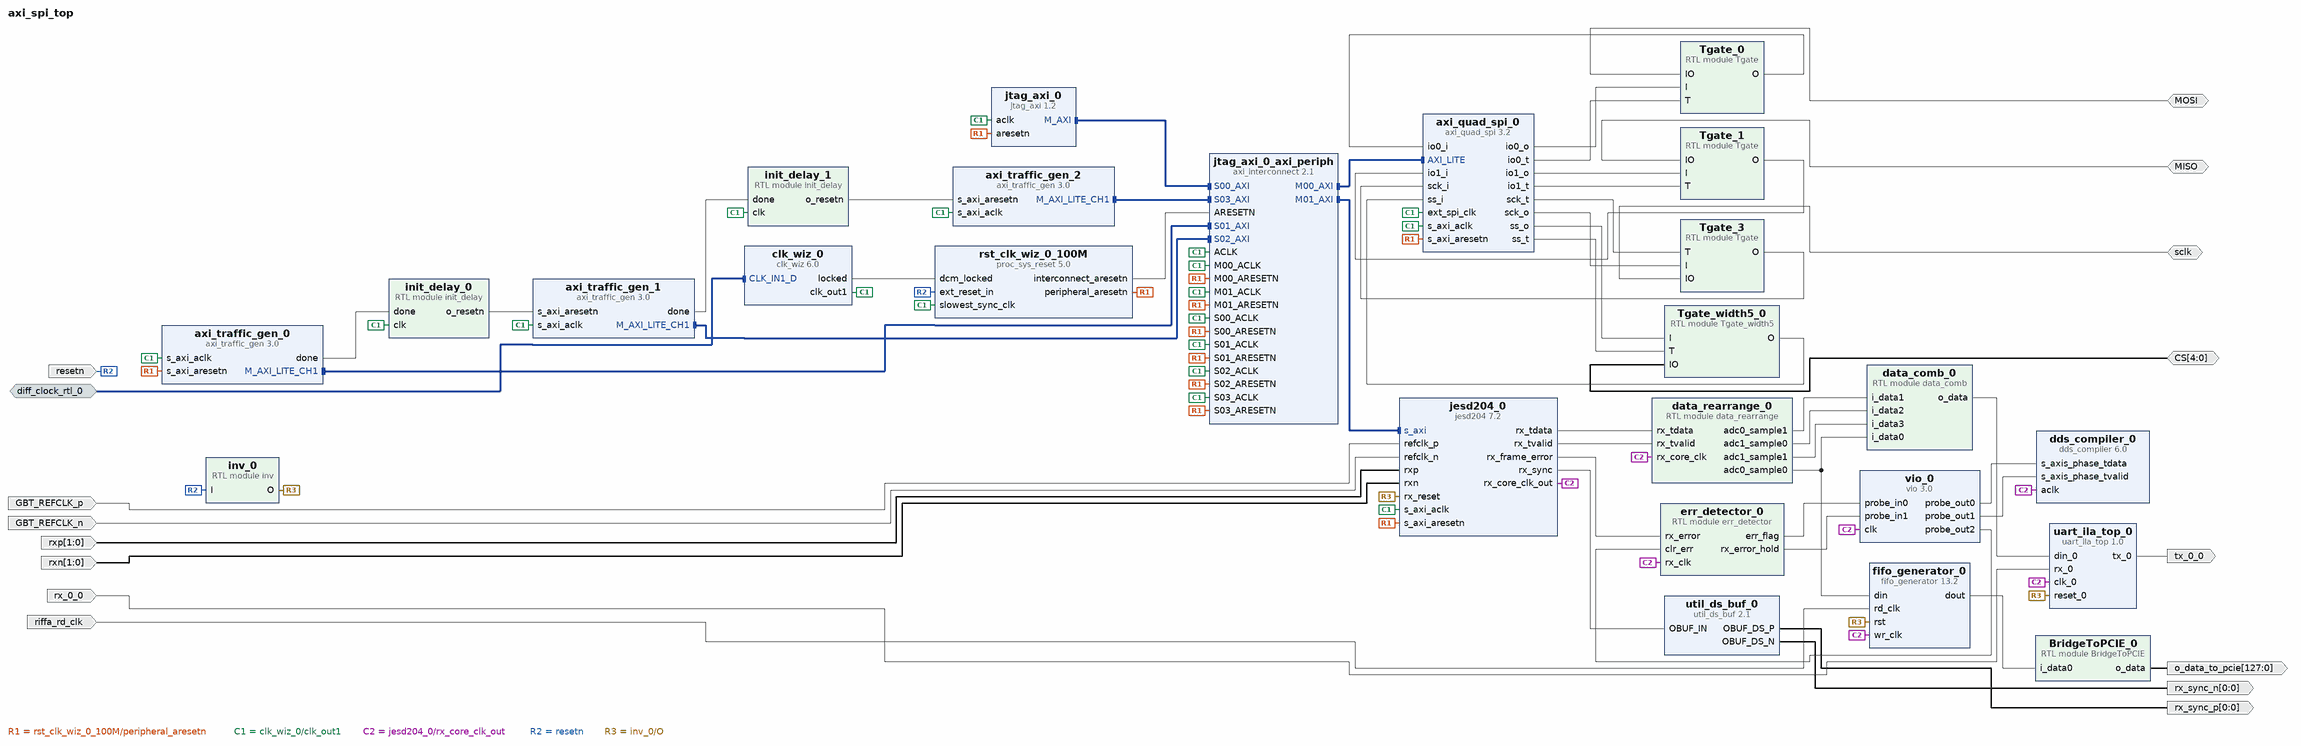
[diagram p0: block diagram of the top level]
# Vivado block design axi_spi_top, xc7k325tffg900-2, Vivado 2018.1
create_bd_design axi_spi_top

create_bd_intf_port -mode Slave -vlnv xilinx.com:interface:diff_clock_rtl:1.0 diff_clock_rtl_0
set_property -dict {CONFIG.FREQ_HZ 200000000} [get_bd_intf_ports diff_clock_rtl_0]
create_bd_port -dir IO -type data MOSI
create_bd_port -dir IO -type data MISO
create_bd_port -dir IO -type clk sclk
set_property -dict {CONFIG.FREQ_HZ 1000000} [get_bd_ports sclk]
create_bd_port -dir IO -from 4 -to 0 CS
create_bd_port -dir I -type clk GBT_REFCLK_p
set_property -dict {CONFIG.FREQ_HZ 125000000} [get_bd_ports GBT_REFCLK_p]
create_bd_port -dir I -type clk GBT_REFCLK_n
set_property -dict {CONFIG.FREQ_HZ 125000000} [get_bd_ports GBT_REFCLK_n]
create_bd_port -dir I -from 1 -to 0 rxp
create_bd_port -dir I -from 1 -to 0 rxn
create_bd_port -dir O -from 0 -to 0 rx_sync_p
create_bd_port -dir O -from 0 -to 0 rx_sync_n
create_bd_port -dir I -type rst resetn
set_property -dict {CONFIG.POLARITY ACTIVE_LOW} [get_bd_ports resetn]
create_bd_port -dir I rx_0_0
create_bd_port -dir O tx_0_0
create_bd_port -dir I -type clk riffa_rd_clk
set_property -dict {CONFIG.FREQ_HZ 100000000} [get_bd_ports riffa_rd_clk]
create_bd_port -dir O -from 127 -to 0 o_data_to_pcie

create_bd_cell -type ip -vlnv xilinx.com:ip:axi_quad_spi:3.2 axi_quad_spi_0
set_property -dict [list \
  CONFIG.C_USE_STARTUP 0 \
  CONFIG.C_NUM_TRANSFER_BITS 16 \
  CONFIG.C_NUM_SS_BITS 5 \
  CONFIG.C_SCK_RATIO 16 \
  CONFIG.C_FIFO_DEPTH 256 \
  CONFIG.Multiples16 5 \
  CONFIG.C_S_AXI4_ID_WIDTH 0 \
] [get_bd_cells axi_quad_spi_0]
create_bd_cell -type ip -vlnv xilinx.com:ip:clk_wiz:6.0 clk_wiz_0
set_property -dict [list \
  CONFIG.PRIM_IN_FREQ 200 \
  CONFIG.CLKIN1_JITTER_PS 50.0 \
  CONFIG.CLKOUT2_USED true \
  CONFIG.CLKOUT3_USED false \
  CONFIG.NUM_OUT_CLKS 2 \
  CONFIG.CLKOUT1_REQUESTED_OUT_FREQ 100 \
  CONFIG.CLKOUT2_REQUESTED_OUT_FREQ 50 \
  CONFIG.CLKOUT3_REQUESTED_OUT_FREQ 5 \
  CONFIG.PRIM_SOURCE Differential_clock_capable_pin \
  CONFIG.MMCM_DIVCLK_DIVIDE 1 \
  CONFIG.MMCM_CLKFBOUT_MULT_F 5.000 \
  CONFIG.MMCM_CLKIN1_PERIOD 5.000 \
  CONFIG.MMCM_CLKIN2_PERIOD 10.0 \
  CONFIG.MMCM_CLKOUT0_DIVIDE_F 10.000 \
  CONFIG.MMCM_CLKOUT1_DIVIDE 20 \
  CONFIG.MMCM_CLKOUT2_DIVIDE 1 \
  CONFIG.CLKOUT1_JITTER 112.316 \
  CONFIG.CLKOUT1_PHASE_ERROR 89.971 \
  CONFIG.CLKOUT2_JITTER 129.198 \
  CONFIG.CLKOUT2_PHASE_ERROR 89.971 \
  CONFIG.CLKOUT3_JITTER 185.602 \
  CONFIG.CLKOUT3_PHASE_ERROR 92.989 \
] [get_bd_cells clk_wiz_0]
create_bd_cell -type ip -vlnv xilinx.com:ip:jtag_axi:1.2 jtag_axi_0
create_bd_cell -type ip -vlnv xilinx.com:ip:axi_interconnect:2.1 jtag_axi_0_axi_periph
set_property -dict {CONFIG.NUM_SI 4 CONFIG.NUM_MI 2} [get_bd_cells jtag_axi_0_axi_periph]
create_bd_cell -type ip -vlnv xilinx.com:ip:proc_sys_reset:5.0 rst_clk_wiz_0_100M
create_bd_cell -type module -reference Tgate Tgate_0
create_bd_cell -type module -reference Tgate Tgate_1
create_bd_cell -type module -reference Tgate Tgate_3
create_bd_cell -type module -reference Tgate_width5 Tgate_width5_0
create_bd_cell -type ip -vlnv xilinx.com:ip:jesd204:7.2 jesd204_0
set_property -dict [list \
  CONFIG.C_NODE_IS_TRANSMIT 0 \
  CONFIG.SupportLevel 1 \
  CONFIG.GT_Line_Rate 5 \
  CONFIG.GT_REFCLK_FREQ 125.000 \
  CONFIG.Global_clk_sel false \
  CONFIG.AXICLK_FREQ 100 \
] [get_bd_cells jesd204_0]
create_bd_cell -type ip -vlnv xilinx.com:ip:util_ds_buf:2.1 util_ds_buf_0
set_property -dict {CONFIG.C_BUF_TYPE OBUFDS} [get_bd_cells util_ds_buf_0]
create_bd_cell -type module -reference inv inv_0
create_bd_cell -type module -reference data_rearrange data_rearrange_0
create_bd_cell -type ip -vlnv xilinx.com:ip:axi_traffic_gen:3.0 axi_traffic_gen_0
set_property -dict [list \
  CONFIG.C_ATG_SYSTEM_INIT_DATA_MIF ../axi_spi_top_axi_traffic_gen_0_data.coe \
  CONFIG.C_ATG_SYSTEM_INIT_ADDR_MIF ../axi_spi_top_axi_traffic_gen_0_address.coe \
  CONFIG.C_ATG_MODE AXI4-Lite \
  CONFIG.C_ATG_MIF_DATA_DEPTH 32 \
] [get_bd_cells axi_traffic_gen_0]
create_bd_cell -type module -reference init_delay init_delay_0
create_bd_cell -type ip -vlnv xilinx.com:ip:axi_traffic_gen:3.0 axi_traffic_gen_1
set_property -dict [list \
  CONFIG.C_ATG_SYSTEM_INIT_DATA_MIF ../axi_spi_top_axi_traffic_gen_1_data.coe \
  CONFIG.C_ATG_SYSTEM_INIT_ADDR_MIF ../axi_spi_top_axi_traffic_gen_1_address.coe \
  CONFIG.C_ATG_MODE AXI4-Lite \
  CONFIG.C_ATG_MIF_DATA_DEPTH 32 \
] [get_bd_cells axi_traffic_gen_1]
create_bd_cell -type ip -vlnv xilinx.com:ip:axi_traffic_gen:3.0 axi_traffic_gen_2
set_property -dict [list \
  CONFIG.C_ATG_SYSTEM_INIT_DATA_MIF ../axi_spi_top_axi_traffic_gen_2_data.coe \
  CONFIG.C_ATG_SYSTEM_INIT_ADDR_MIF ../axi_spi_top_axi_traffic_gen_2_address.coe \
  CONFIG.C_ATG_MODE AXI4-Lite \
  CONFIG.C_ATG_MIF_DATA_DEPTH 32 \
] [get_bd_cells axi_traffic_gen_2]
create_bd_cell -type module -reference init_delay init_delay_1
create_bd_cell -type ip -vlnv xilinx.com:ip:dds_compiler:6.0 dds_compiler_0
set_property -dict [list \
  CONFIG.DDS_Clock_Rate 125 \
  CONFIG.Channels 1 \
  CONFIG.Parameter_Entry Hardware_Parameters \
  CONFIG.Frequency_Resolution 0.4 \
  CONFIG.Noise_Shaping None \
  CONFIG.Phase_Width 16 \
  CONFIG.Output_Width 14 \
  CONFIG.Phase_Increment Streaming \
  CONFIG.Output_Selection Sine \
  CONFIG.Has_Phase_Out false \
  CONFIG.DATA_Has_TLAST Not_Required \
  CONFIG.S_PHASE_Has_TUSER Not_Required \
  CONFIG.M_DATA_Has_TUSER Not_Required \
  CONFIG.M_PHASE_Has_TUSER Not_Required \
  CONFIG.Latency 7 \
  CONFIG.Output_Frequency1 0 \
  CONFIG.PINC1 0 \
] [get_bd_cells dds_compiler_0]
create_bd_cell -type ip -vlnv xilinx.com:ip:vio:3.0 vio_0
set_property -dict [list \
  CONFIG.C_PROBE_OUT1_INIT_VAL 0x1 \
  CONFIG.C_PROBE_OUT0_WIDTH 16 \
  CONFIG.C_NUM_PROBE_OUT 3 \
  CONFIG.C_EN_PROBE_IN_ACTIVITY 0 \
  CONFIG.C_NUM_PROBE_IN 2 \
] [get_bd_cells vio_0]
create_bd_cell -type module -reference err_detector err_detector_0
create_bd_cell -type module -reference data_comb data_comb_0
create_bd_cell -type ip -vlnv xilinx.com:user:uart_ila_top:1.0 uart_ila_top_0
create_bd_cell -type ip -vlnv xilinx.com:ip:fifo_generator:13.2 fifo_generator_0
set_property -dict [list \
  CONFIG.Fifo_Implementation Independent_Clocks_Block_RAM \
  CONFIG.Input_Data_Width 14 \
  CONFIG.Output_Data_Width 14 \
  CONFIG.Reset_Pin true \
  CONFIG.Full_Flags_Reset_Value 1 \
  CONFIG.Use_Dout_Reset true \
  CONFIG.Enable_Safety_Circuit true \
] [get_bd_cells fifo_generator_0]
create_bd_cell -type module -reference BridgeToPCIE BridgeToPCIE_0

# ---- connections ----

connect_bd_intf_net [get_bd_intf_pins jtag_axi_0/M_AXI] [get_bd_intf_pins jtag_axi_0_axi_periph/S00_AXI]
connect_bd_intf_net [get_bd_intf_pins jtag_axi_0_axi_periph/M00_AXI] [get_bd_intf_pins axi_quad_spi_0/AXI_LITE]
connect_bd_intf_net [get_bd_intf_pins jesd204_0/s_axi] [get_bd_intf_pins jtag_axi_0_axi_periph/M01_AXI]
connect_bd_intf_net [get_bd_intf_pins axi_traffic_gen_0/M_AXI_LITE_CH1] [get_bd_intf_pins jtag_axi_0_axi_periph/S01_AXI]
connect_bd_intf_net [get_bd_intf_pins axi_traffic_gen_1/M_AXI_LITE_CH1] [get_bd_intf_pins jtag_axi_0_axi_periph/S02_AXI]
connect_bd_intf_net [get_bd_intf_pins axi_traffic_gen_2/M_AXI_LITE_CH1] [get_bd_intf_pins jtag_axi_0_axi_periph/S03_AXI]
connect_bd_intf_net -intf_net diff_clock_rtl_0_1 [get_bd_intf_ports diff_clock_rtl_0] [get_bd_intf_pins clk_wiz_0/CLK_IN1_D]
connect_bd_net [get_bd_pins clk_wiz_0/locked] [get_bd_pins rst_clk_wiz_0_100M/dcm_locked]
connect_bd_net [get_bd_pins rst_clk_wiz_0_100M/peripheral_aresetn] \
  [get_bd_pins axi_quad_spi_0/s_axi_aresetn] [get_bd_pins jtag_axi_0/aresetn] [get_bd_pins jesd204_0/s_axi_aresetn] \
  [get_bd_pins axi_traffic_gen_0/s_axi_aresetn] [get_bd_pins jtag_axi_0_axi_periph/S00_ARESETN] \
  [get_bd_pins jtag_axi_0_axi_periph/M00_ARESETN] [get_bd_pins jtag_axi_0_axi_periph/M01_ARESETN] \
  [get_bd_pins jtag_axi_0_axi_periph/S01_ARESETN] [get_bd_pins jtag_axi_0_axi_periph/S02_ARESETN] \
  [get_bd_pins jtag_axi_0_axi_periph/S03_ARESETN]
connect_bd_net [get_bd_pins rst_clk_wiz_0_100M/interconnect_aresetn] [get_bd_pins jtag_axi_0_axi_periph/ARESETN]
connect_bd_net [get_bd_pins Tgate_0/O] [get_bd_pins axi_quad_spi_0/io0_i]
connect_bd_net [get_bd_pins axi_quad_spi_0/io0_o] [get_bd_pins Tgate_0/I]
connect_bd_net [get_bd_pins axi_quad_spi_0/io0_t] [get_bd_pins Tgate_0/T]
connect_bd_net [get_bd_pins axi_quad_spi_0/io1_o] [get_bd_pins Tgate_1/I]
connect_bd_net [get_bd_pins Tgate_1/O] [get_bd_pins axi_quad_spi_0/io1_i]
connect_bd_net [get_bd_pins axi_quad_spi_0/io1_t] [get_bd_pins Tgate_1/T]
connect_bd_net [get_bd_pins axi_quad_spi_0/ss_o] [get_bd_pins Tgate_width5_0/I]
connect_bd_net [get_bd_pins axi_quad_spi_0/ss_t] [get_bd_pins Tgate_width5_0/T]
connect_bd_net [get_bd_ports MOSI] [get_bd_pins Tgate_0/IO]
connect_bd_net [get_bd_ports MISO] [get_bd_pins Tgate_1/IO]
connect_bd_net [get_bd_pins axi_quad_spi_0/sck_t] [get_bd_pins Tgate_3/T]
connect_bd_net [get_bd_pins Tgate_3/O] [get_bd_pins axi_quad_spi_0/sck_i]
connect_bd_net [get_bd_pins axi_quad_spi_0/sck_o] [get_bd_pins Tgate_3/I]
connect_bd_net [get_bd_ports sclk] [get_bd_pins Tgate_3/IO]
connect_bd_net [get_bd_ports CS] [get_bd_pins Tgate_width5_0/IO]
connect_bd_net [get_bd_pins Tgate_width5_0/O] [get_bd_pins axi_quad_spi_0/ss_i]
connect_bd_net [get_bd_pins clk_wiz_0/clk_out1] \
  [get_bd_pins axi_quad_spi_0/ext_spi_clk] [get_bd_pins axi_quad_spi_0/s_axi_aclk] [get_bd_pins jtag_axi_0/aclk] \
  [get_bd_pins rst_clk_wiz_0_100M/slowest_sync_clk] [get_bd_pins jesd204_0/s_axi_aclk] \
  [get_bd_pins axi_traffic_gen_0/s_axi_aclk] [get_bd_pins axi_traffic_gen_1/s_axi_aclk] \
  [get_bd_pins axi_traffic_gen_2/s_axi_aclk] [get_bd_pins init_delay_0/clk] [get_bd_pins init_delay_1/clk] \
  [get_bd_pins jtag_axi_0_axi_periph/ACLK] [get_bd_pins jtag_axi_0_axi_periph/S00_ACLK] \
  [get_bd_pins jtag_axi_0_axi_periph/M00_ACLK] [get_bd_pins jtag_axi_0_axi_periph/M01_ACLK] \
  [get_bd_pins jtag_axi_0_axi_periph/S01_ACLK] [get_bd_pins jtag_axi_0_axi_periph/S02_ACLK] \
  [get_bd_pins jtag_axi_0_axi_periph/S03_ACLK]
connect_bd_net [get_bd_ports GBT_REFCLK_p] [get_bd_pins jesd204_0/refclk_p]
connect_bd_net [get_bd_ports GBT_REFCLK_n] [get_bd_pins jesd204_0/refclk_n]
connect_bd_net [get_bd_ports rxp] [get_bd_pins jesd204_0/rxp]
connect_bd_net [get_bd_ports rxn] [get_bd_pins jesd204_0/rxn]
connect_bd_net [get_bd_pins jesd204_0/rx_tdata] [get_bd_pins data_rearrange_0/rx_tdata]
connect_bd_net [get_bd_pins jesd204_0/rx_sync] [get_bd_pins util_ds_buf_0/OBUF_IN]
connect_bd_net [get_bd_pins util_ds_buf_0/OBUF_DS_P] [get_bd_ports rx_sync_p]
connect_bd_net [get_bd_pins util_ds_buf_0/OBUF_DS_N] [get_bd_ports rx_sync_n]
connect_bd_net [get_bd_pins jesd204_0/rx_core_clk_out] \
  [get_bd_pins data_rearrange_0/rx_core_clk] [get_bd_pins dds_compiler_0/aclk] [get_bd_pins vio_0/clk] \
  [get_bd_pins err_detector_0/rx_clk] [get_bd_pins uart_ila_top_0/clk_0] [get_bd_pins fifo_generator_0/wr_clk]
connect_bd_net [get_bd_ports resetn] [get_bd_pins rst_clk_wiz_0_100M/ext_reset_in] [get_bd_pins inv_0/I]
connect_bd_net [get_bd_pins inv_0/O] [get_bd_pins jesd204_0/rx_reset] [get_bd_pins uart_ila_top_0/reset_0] [get_bd_pins fifo_generator_0/rst]
connect_bd_net [get_bd_pins jesd204_0/rx_tvalid] [get_bd_pins data_rearrange_0/rx_tvalid]
connect_bd_net [get_bd_pins axi_traffic_gen_0/done] [get_bd_pins init_delay_0/done]
connect_bd_net [get_bd_pins init_delay_0/o_resetn] [get_bd_pins axi_traffic_gen_1/s_axi_aresetn]
connect_bd_net [get_bd_pins axi_traffic_gen_1/done] [get_bd_pins init_delay_1/done]
connect_bd_net [get_bd_pins init_delay_1/o_resetn] [get_bd_pins axi_traffic_gen_2/s_axi_aresetn]
connect_bd_net [get_bd_pins data_rearrange_0/adc0_sample1] [get_bd_pins data_comb_0/i_data1]
connect_bd_net [get_bd_pins data_rearrange_0/adc0_sample0] [get_bd_pins data_comb_0/i_data0] [get_bd_pins fifo_generator_0/din]
connect_bd_net [get_bd_pins data_comb_0/o_data] [get_bd_pins uart_ila_top_0/din_0]
connect_bd_net -net rx_0_0_1 [get_bd_ports rx_0_0] [get_bd_pins uart_ila_top_0/rx_0]
connect_bd_net [get_bd_pins uart_ila_top_0/tx_0] [get_bd_ports tx_0_0]
connect_bd_net [get_bd_pins vio_0/probe_out0] [get_bd_pins dds_compiler_0/s_axis_phase_tdata]
connect_bd_net [get_bd_pins vio_0/probe_out1] [get_bd_pins dds_compiler_0/s_axis_phase_tvalid]
connect_bd_net [get_bd_pins data_rearrange_0/adc1_sample0] [get_bd_pins data_comb_0/i_data2]
connect_bd_net [get_bd_pins data_rearrange_0/adc1_sample1] [get_bd_pins data_comb_0/i_data3]
connect_bd_net [get_bd_pins jesd204_0/rx_frame_error] [get_bd_pins err_detector_0/rx_error]
connect_bd_net [get_bd_pins err_detector_0/err_flag] [get_bd_pins vio_0/probe_in0]
connect_bd_net [get_bd_pins vio_0/probe_out2] [get_bd_pins err_detector_0/clr_err]
connect_bd_net [get_bd_pins err_detector_0/rx_error_hold] [get_bd_pins vio_0/probe_in1]
connect_bd_net [get_bd_ports riffa_rd_clk] [get_bd_pins fifo_generator_0/rd_clk]
connect_bd_net [get_bd_pins fifo_generator_0/dout] [get_bd_pins BridgeToPCIE_0/i_data0]
connect_bd_net [get_bd_pins BridgeToPCIE_0/o_data] [get_bd_ports o_data_to_pcie]

# ---- address map ----
assign_bd_address -offset 0x44A00000 -range 64K -target_address_space [get_bd_addr_spaces axi_traffic_gen_0/Reg1] [get_bd_addr_segs axi_quad_spi_0/AXI_LITE/Reg]
assign_bd_address -offset 0x44A10000 -range 64K -target_address_space [get_bd_addr_spaces axi_traffic_gen_0/Reg1] [get_bd_addr_segs jesd204_0/s_axi/Reg]
assign_bd_address -offset 0x44A00000 -range 64K -target_address_space [get_bd_addr_spaces axi_traffic_gen_1/Reg1] [get_bd_addr_segs axi_quad_spi_0/AXI_LITE/Reg]
assign_bd_address -offset 0x44A10000 -range 64K -target_address_space [get_bd_addr_spaces axi_traffic_gen_1/Reg1] [get_bd_addr_segs jesd204_0/s_axi/Reg]
assign_bd_address -offset 0x44A00000 -range 64K -target_address_space [get_bd_addr_spaces axi_traffic_gen_2/Reg1] [get_bd_addr_segs axi_quad_spi_0/AXI_LITE/Reg]
assign_bd_address -offset 0x44A10000 -range 64K -target_address_space [get_bd_addr_spaces axi_traffic_gen_2/Reg1] [get_bd_addr_segs jesd204_0/s_axi/Reg]
assign_bd_address -offset 0x44A00000 -range 64K -target_address_space [get_bd_addr_spaces jtag_axi_0/Data] [get_bd_addr_segs axi_quad_spi_0/AXI_LITE/Reg]
assign_bd_address -offset 0x44A10000 -range 64K -target_address_space [get_bd_addr_spaces jtag_axi_0/Data] [get_bd_addr_segs jesd204_0/s_axi/Reg]

validate_bd_design
save_bd_design
